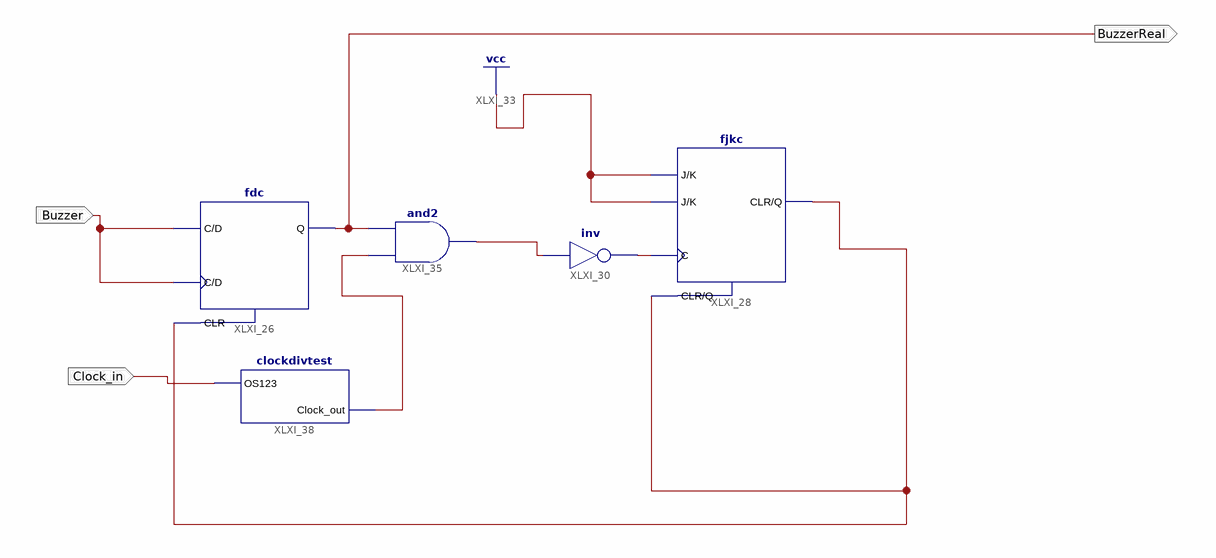
[diagram p0: schematic sheet 1]
// Xilinx ISE schematic counter.sch (spartan6) as structural Verilog: 5 symbols, 3 ports
module counter (
  input  Buzzer,
  input  Clock_in,
  output BuzzerReal
);

  wire XLXN_100, XLXN_105, XLXN_109, XLXN_118;

  fdc XLXI_26 (.C(Buzzer), .CLR(XLXN_105), .D(Buzzer), .Q(BuzzerReal));
  fjkc XLXI_28 (.C(XLXN_100), .CLR(XLXN_105), .J(1'b1), .K(1'b1), .Q(XLXN_105));
  not XLXI_30 (XLXN_100, XLXN_109);
  and XLXI_35 (XLXN_109, XLXN_118, BuzzerReal);
  clockdivtest XLXI_38 (.OS123(Clock_in), .Clock_out(XLXN_118));
endmodule
